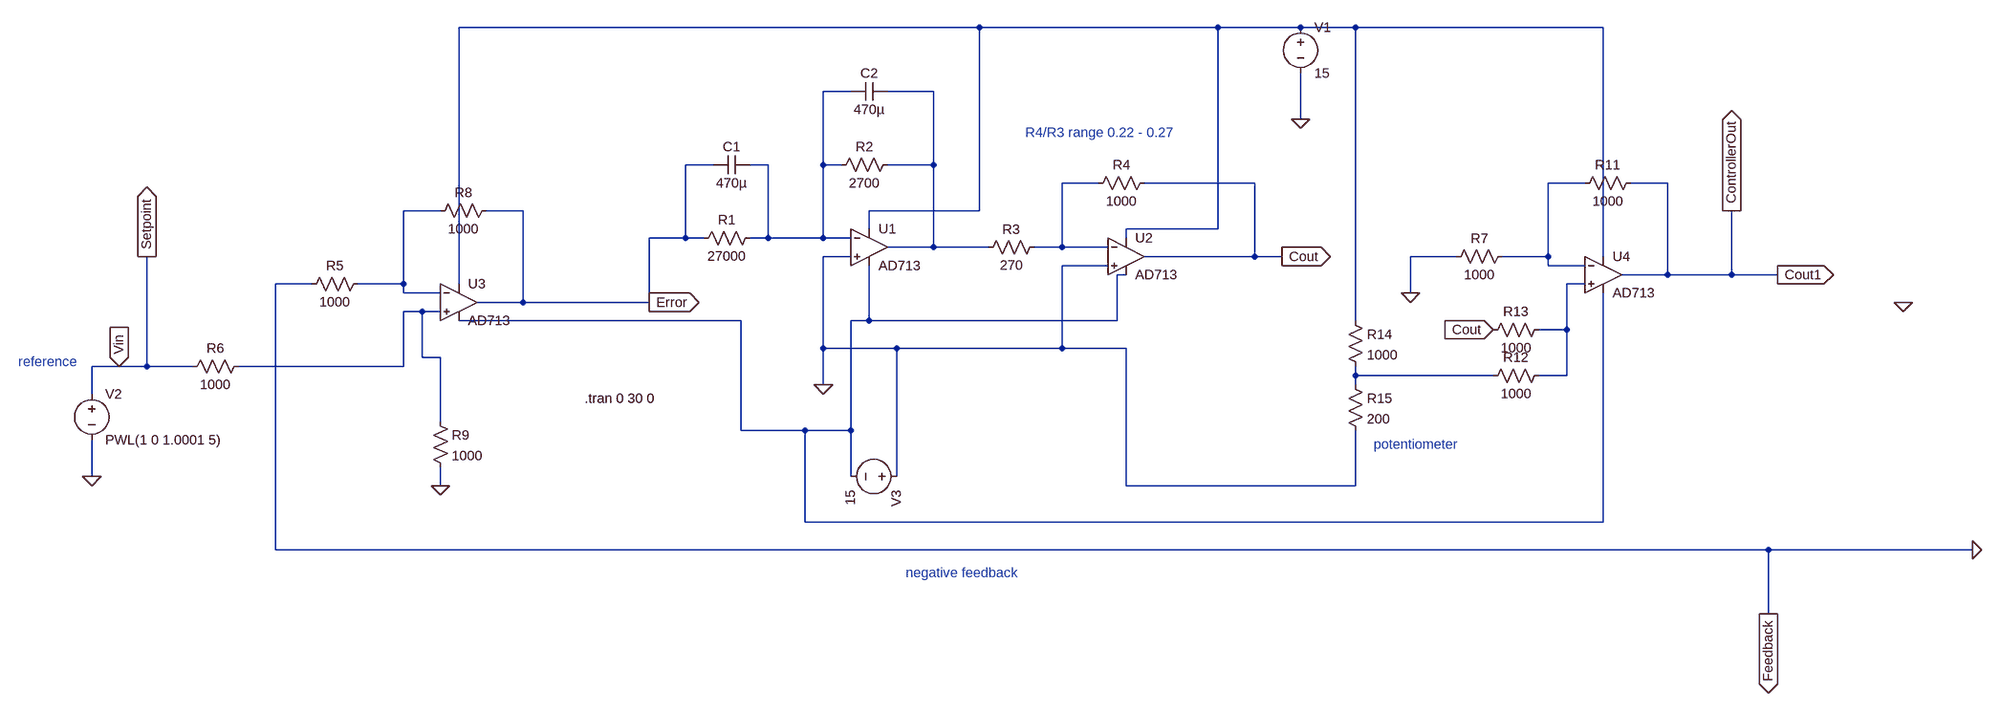
[diagram p0: schematic ltspicemodel.asc]
ltspicemodel.asc, the LTspice schematic file:
Version 4
SHEET 1 2740 2408
WIRE 448 -80 -528 -80
WIRE 864 -80 448 -80
WIRE 1008 -80 864 -80
WIRE 1104 -80 1008 -80
WIRE 1536 -80 1104 -80
WIRE 224 32 176 32
WIRE 368 32 288 32
WIRE 1008 80 1008 0
WIRE -16 160 -64 160
WIRE 80 160 48 160
WIRE 176 160 176 32
WIRE 208 160 176 160
WIRE 368 160 368 32
WIRE 368 160 288 160
WIRE 656 192 592 192
WIRE 928 192 736 192
WIRE 1504 192 1440 192
WIRE 1648 192 1584 192
WIRE -560 240 -624 240
WIRE -416 240 -480 240
WIRE 448 240 448 -80
WIRE 448 240 256 240
WIRE 256 272 256 240
WIRE 864 272 864 -80
WIRE 864 272 704 272
WIRE -64 288 -64 160
WIRE -64 288 -128 288
WIRE -32 288 -64 288
WIRE 80 288 80 160
WIRE 80 288 48 288
WIRE 176 288 176 160
WIRE 176 288 80 288
WIRE 224 288 176 288
WIRE 704 288 704 272
WIRE 368 304 368 160
WIRE 368 304 288 304
WIRE 464 304 368 304
WIRE 592 304 592 192
WIRE 592 304 544 304
WIRE 672 304 592 304
WIRE 224 320 176 320
WIRE 928 320 928 192
WIRE 928 320 736 320
WIRE 976 320 928 320
WIRE 1280 320 1200 320
WIRE 1440 320 1440 192
WIRE 1440 320 1360 320
WIRE 1536 320 1536 -80
WIRE 672 336 592 336
WIRE 1440 336 1440 320
WIRE 1504 336 1440 336
WIRE 704 352 688 352
WIRE 1648 352 1648 192
WIRE 1648 352 1568 352
WIRE 1760 352 1760 240
WIRE 1760 352 1648 352
WIRE 1840 352 1760 352
WIRE -784 368 -848 368
WIRE -624 368 -624 240
WIRE -624 368 -704 368
WIRE -528 368 -528 -80
WIRE 1504 368 1472 368
WIRE -624 384 -624 368
WIRE -560 384 -624 384
WIRE 1200 384 1200 320
WIRE -416 400 -416 240
WIRE -416 400 -496 400
WIRE -128 400 -128 288
WIRE -128 400 -416 400
WIRE -592 416 -624 416
WIRE -560 416 -592 416
WIRE 32 432 -528 432
WIRE 256 432 256 336
WIRE 256 432 224 432
WIRE 688 432 688 352
WIRE 688 432 256 432
WIRE 1104 432 1104 -80
WIRE 1472 448 1472 368
WIRE 1472 448 1424 448
WIRE 176 480 176 320
WIRE 304 480 176 480
WIRE 592 480 592 336
WIRE 592 480 304 480
WIRE 704 480 592 480
WIRE -592 496 -592 416
WIRE -560 496 -592 496
WIRE -1120 512 -1168 512
WIRE -1072 512 -1072 320
WIRE -1072 512 -1120 512
WIRE -992 512 -1072 512
WIRE -624 512 -624 416
WIRE -624 512 -912 512
WIRE 1104 528 1104 512
WIRE 1344 528 1104 528
WIRE 1472 528 1472 448
WIRE 1472 528 1424 528
WIRE 176 544 176 480
WIRE 1104 544 1104 528
WIRE -1168 560 -1168 512
WIRE -560 608 -560 496
WIRE 32 624 32 432
WIRE 144 624 32 624
WIRE 224 624 224 432
WIRE 224 624 144 624
WIRE -1168 704 -1168 640
WIRE 224 704 224 624
WIRE 304 704 304 480
WIRE -560 720 -560 688
WIRE 704 720 704 480
WIRE 1104 720 1104 624
WIRE 1104 720 704 720
WIRE 144 784 144 624
WIRE 1536 784 1536 384
WIRE 1536 784 144 784
WIRE -848 832 -848 368
WIRE 1824 832 -848 832
WIRE 2720 832 1824 832
WIRE 1824 944 1824 832
FLAG 176 544 0
FLAG 1008 80 0
FLAG 976 320 Cout
IOPIN 976 320 Out
FLAG -1168 704 0
FLAG -560 720 0
FLAG -1120 512 Vin
IOPIN -1120 512 In
FLAG -128 400 Error
IOPIN -128 400 Out
FLAG 1200 384 0
FLAG 1344 448 Cout
IOPIN 1344 448 In
FLAG 1840 352 Cout1
IOPIN 1840 352 Out
FLAG -1072 320 Setpoint
IOPIN -1072 320 Out
FLAG 1760 240 ControllerOut
IOPIN 1760 240 Out
FLAG 1824 944 Feedback
IOPIN 1824 944 Out
FLAG 2720 832 0
FLAG 2224 400 0
SYMBOL res 64 272 R90
WINDOW 0 0 56 VBottom 2
WINDOW 3 32 56 VTop 2
SYMATTR InstName R1
SYMATTR Value 27000
SYMBOL res 304 144 R90
WINDOW 0 0 56 VBottom 2
WINDOW 3 32 56 VTop 2
SYMATTR InstName R2
SYMATTR Value 2700
SYMBOL res 560 288 R90
WINDOW 0 0 56 VBottom 2
WINDOW 3 32 56 VTop 2
SYMATTR InstName R3
SYMATTR Value 270
SYMBOL res 752 176 R90
WINDOW 0 0 56 VBottom 2
WINDOW 3 32 56 VTop 2
SYMATTR InstName R4
SYMATTR Value 1000
SYMBOL cap 48 144 R90
WINDOW 0 0 32 VBottom 2
WINDOW 3 32 32 VTop 2
SYMATTR InstName C1
SYMATTR Value 470µ
SYMBOL cap 288 16 R90
WINDOW 0 0 32 VBottom 2
WINDOW 3 32 32 VTop 2
SYMATTR InstName C2
SYMATTR Value 470µ
SYMBOL voltage 1008 -96 R0
WINDOW 123 0 0 Left 0
WINDOW 39 0 0 Left 0
SYMATTR InstName V1
SYMATTR Value 15
SYMBOL voltage -1168 544 R0
WINDOW 123 0 0 Left 0
WINDOW 39 0 0 Left 0
SYMATTR InstName V2
SYMATTR Value PWL(1 0 1.0001 5)
SYMBOL OpAmps\\AD713 256 240 R0
SYMATTR InstName U1
SYMBOL OpAmps\\AD713 704 256 R0
SYMATTR InstName U2
SYMBOL voltage 320 704 R90
WINDOW 123 0 0 Left 0
WINDOW 39 0 0 Left 0
SYMATTR InstName V3
SYMATTR Value 15
SYMBOL OpAmps\\AD713 -528 336 R0
SYMATTR InstName U3
SYMBOL res -688 352 R90
WINDOW 0 0 56 VBottom 2
WINDOW 3 32 56 VTop 2
SYMATTR InstName R5
SYMATTR Value 1000
SYMBOL res -896 496 R90
WINDOW 0 0 56 VBottom 2
WINDOW 3 32 56 VTop 2
SYMATTR InstName R6
SYMATTR Value 1000
SYMBOL res -464 224 R90
WINDOW 0 0 56 VBottom 2
WINDOW 3 32 56 VTop 2
SYMATTR InstName R8
SYMATTR Value 1000
SYMBOL res -576 592 R0
SYMATTR InstName R9
SYMATTR Value 1000
SYMBOL OpAmps\\AD713 1536 288 R0
SYMATTR InstName U4
SYMBOL res 1376 304 R90
WINDOW 0 0 56 VBottom 2
WINDOW 3 32 56 VTop 2
SYMATTR InstName R7
SYMATTR Value 1000
SYMBOL res 1600 176 R90
WINDOW 0 0 56 VBottom 2
WINDOW 3 32 56 VTop 2
SYMATTR InstName R11
SYMATTR Value 1000
SYMBOL res 1440 512 R90
WINDOW 0 0 56 VBottom 2
WINDOW 3 32 56 VTop 2
SYMATTR InstName R12
SYMATTR Value 1000
SYMBOL res 1440 432 R90
WINDOW 0 0 56 VBottom 2
WINDOW 3 32 56 VTop 2
SYMATTR InstName R13
SYMATTR Value 1000
SYMBOL res 1088 416 R0
SYMATTR InstName R14
SYMATTR Value 1000
SYMBOL res 1088 528 R0
SYMATTR InstName R15
SYMATTR Value 200
TEXT -240 568 Left 2 !.tran 0 30 0
TEXT 320 872 Left 2 ;negative feedback
TEXT -1296 504 Left 2 ;reference
TEXT 1136 648 Left 2 ;potentiometer
TEXT 528 104 Left 2 ;R4/R3 range 0.22 - 0.27

The netlist it stands for:
* ltspicemodel.asc
R1 N002 Error 27000
R2 N003 N002 2700
R3 N004 N003 270
R4 Cout N004 1000
C1 N002 Error 470µ
C2 N003 N002 470µ
V1 N001 0 15
V2 Setpoint 0 PWL(1 0 1.0001 5)
XU1 0 N002 N001 N007 N003 AD712  ; AD713, pins In+ In- V+ V- OUT
XU2 0 N004 N001 N007 Cout AD712  ; AD713, pins In+ In- V+ V- OUT
V3 0 N007 15
XU3 N009 N006 N001 N007 Error AD712  ; AD713, pins In+ In- V+ V- OUT
R5 N006 0 1000
R6 N009 Setpoint 1000
R8 Error N006 1000
R9 N009 0 1000
XU4 N008 N005 N001 N007 ControllerOut AD712  ; AD713, pins In+ In- V+ V- OUT
R7 N005 0 1000
R11 ControllerOut N005 1000
R12 N008 N010 1000
R13 N008 Cout 1000
R14 N001 N010 1000
R15 N010 0 200
.tran 0 30 0
* negative feedback
* reference
* potentiometer
* R4/R3 range 0.22 - 0.27
.lib ADI1.lib
.backanno
.end